# EAGLE schematic schematic_force_sensitive_resistor_driver (EAGLE 9.3.0)
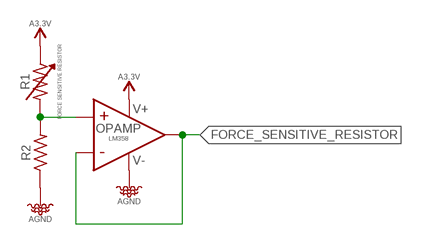
[diagram p0: schematic, sheet 1]

## Parts
OPAMP  OPAMP_ILLUSTRATIVE  [SOT95P280X145-5]
R1  FORCE SENSITIVE RESISTOR  VARIABLE_PTH_10K-1/5W-20%_ACTLEN-25_OFFBOARD  [PTH-CONNECTOR-2PIN]
R2  10K  10KΩ_SMD-0402_1/16W-5%  [RESC1005X35_SMD-0402]

## Nets
A3.3V: OPAMP.4(V+) R1.1
AGND [ASIG]: OPAMP.5(V-) R2.1
FORCE_SENSITIVE_RESISTOR: OPAMP.2(IN-) OPAMP.3(OUT)
N$1004: OPAMP.1(IN+) R1.2 R2.2

## Notes on the sheet
- LM358

## Library data of the parts
OPAMP = _op_amps:OPAMP_ILLUSTRATIVE: THIS OP AMP IS USELESS. For illustrative purposes only.
R1 = _resistors:VARIABLE; CREATOR: MrSwirlyEyes; DATASHEET: http://www.ttelectronics.com/sites/default/files/download-files/Datasheet_RotaryPanelPot_P160series.pdf; DIST: Digikey; DISTLINK: https://www.digikey.com/products/en?keywords=987-1715-ND; DISTPN: 987-1715-ND; MFR: TT Electronics/BI; MPN: P160KN2-0QA25B10K; VALUE: 10KΩ
R2 = _resistors:10KΩ; DATASHEET: http://www.yageo.com/NewPortal/yageodocoutput?fileName=/pdf/R-Chip/PYu-RC_51_RoHS_P_0.pdf; DIST: Digikey; DISTLINK: https://www.digikey.com/products/en?keywords=YAG1281CT-ND; DISTPN: YAG1281CT-ND; MFR: Yageo; MPN: RC0402JR-0710KP

## Net classes
3 ASIG: width 0.254 mm